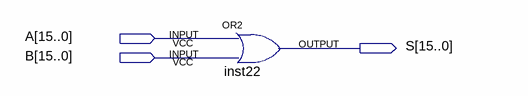
[diagram p0: schematic sheet]
// Quartus schematic ORR.bdf as structural Verilog: 1 symbols, 3 pins
module ORR (
  input  [15:0] A,
  input  [15:0] B,
  output [15:0] S
);

  assign S = A | B;  // OR2 inst22, 16 bits wide
endmodule
